# EAGLE design MOD-Y_cold_V03 (EAGLE 9.6.2)

## Sheet 1 of 2
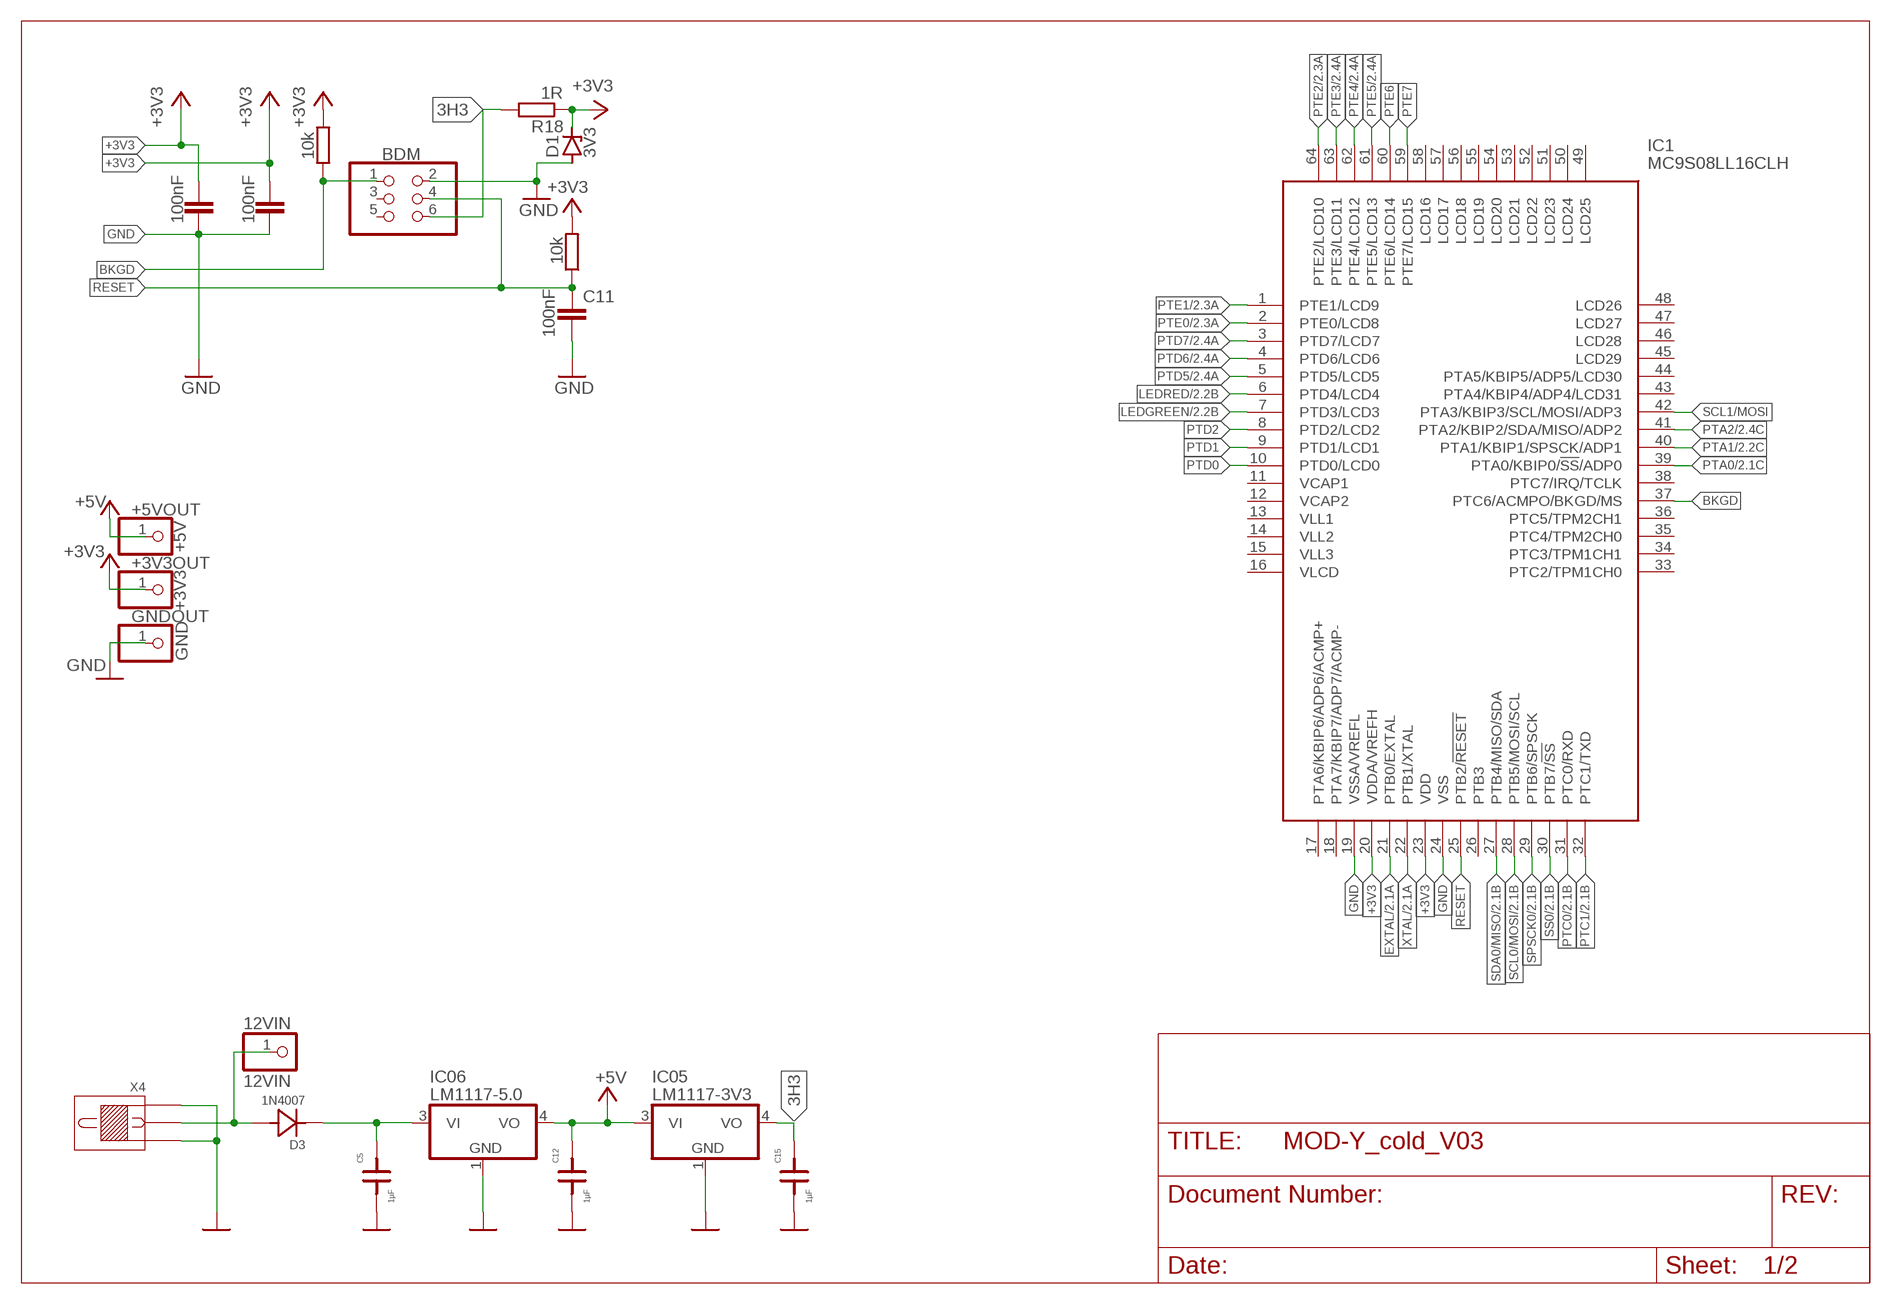
[diagram p0: schematic, sheet 1]

### Parts
12VIN  12VIN  PINHD-1X1  [1X01]
+3V3OUT  +3V3  PINHD-1X1  [1X01]
+5VOUT  +5V  PINHD-1X1  [1X01]
BDM  PINHD-2X3  [2X03]
C5  1µF  C1  [0805F]
C9  100nF  C-EUC0805  [C0805]
C10  100nF  C-EUC0805  [C0805]
C11  100nF  C-EUC0805  [C0805]
C12  1µF  C1  [0805F]
C15  1µF  C1  [0805F]
D1  3V3  ZENER-DIODESOD80C  [SOD80C]
D3  1N4007  DHCMELF  [MELF_B]
GNDOUT  GND  PINHD-1X1  [1X01]
IC1  MC9S08LL16CLH  [QFP50P1200X1200X160-64N]
IC05  LM1117-3V3  LM1117DT  [DPAK]
IC06  LM1117-5.0  LM1117DT  [DPAK]
R16  10k  R-EU_R0805  [R0805]
R17  10k  R-EU_R0805  [R0805]
R18  1R  R-EU_R0805  [R0805]
X4  SPP  [SPP]

### Nets
3H3: BDM.6 C15.2 IC05.4(VO) R18.2
+3V3: +3V3OUT.1 C9.1 C10.1 D1.C IC1.20(VDDA/VREFH) IC1.23(VDD) R16.2 R17.2 R18.1 ; also sheet 2
+5V: +5VOUT.1 C12.2 IC05.3(VI) IC06.4(VO) ; also sheet 2
BKGD: BDM.1 IC1.37(PTC6/ACMPO/BKGD/MS) R16.1
EXTAL: IC1.21(PTB0/EXTAL) ; also sheet 2
GND: BDM.2 C5.1 C9.2 C10.2 C11.2 C12.1 C15.1 D1.A GNDOUT.1 IC1.19(VSSA/VREFL) IC1.24(VSS) IC05.1(GND) IC06.1(GND) X4.1 X4.3 ; also sheet 2
LEDGREEN: IC1.7(PTD3/LCD3) ; also sheet 2
LEDRED: IC1.6(PTD4/LCD4) ; also sheet 2
N$70: C5.2 D3.K IC06.3(VI)
N$71: 12VIN.1 D3.A X4.2
PTA0: IC1.39(PTA0/KBIP0/!SS!/ADP0) ; also sheet 2
PTA1: IC1.40(PTA1/KBIP1/SPSCK/ADP1) ; also sheet 2
PTA2: IC1.41(PTA2/KBIP2/SDA/MISO/ADP2) ; also sheet 2
PTC0: IC1.31(PTC0/RXD) ; also sheet 2
PTC1: IC1.32(PTC1/TXD) ; also sheet 2
PTD0: IC1.10(PTD0/LCD0)
PTD1: IC1.9(PTD1/LCD1)
PTD2: IC1.8(PTD2/LCD2)
PTD5: IC1.5(PTD5/LCD5) ; also sheet 2
PTD6: IC1.4(PTD6/LCD6) ; also sheet 2
PTD7: IC1.3(PTD7/LCD7) ; also sheet 2
PTE0: IC1.2(PTE0/LCD8) ; also sheet 2
PTE1: IC1.1(PTE1/LCD9) ; also sheet 2
PTE2: IC1.64(PTE2/LCD10) ; also sheet 2
PTE3: IC1.63(PTE3/LCD11) ; also sheet 2
PTE4: IC1.62(PTE4/LCD12) ; also sheet 2
PTE5: IC1.61(PTE5/LCD13) ; also sheet 2
PTE6: IC1.60(PTE6/LCD14)
PTE7: IC1.59(PTE7/LCD15)
RESET: BDM.4 C11.1 IC1.25(PTB2/!RESET) R17.1
SCL0/MOSI: IC1.28(PTB5/MOSI/SCL) ; also sheet 2
SCL1/MOSI: IC1.42(PTA3/KBIP3/SCL/MOSI/ADP3)
SDA0/MISO: IC1.27(PTB4/MISO/SDA) ; also sheet 2
SPSCK0: IC1.29(PTB6/SPSCK) ; also sheet 2
SS0: IC1.30(PTB7/!SS) ; also sheet 2
XTAL: IC1.22(PTB1/XTAL) ; also sheet 2
Unconnected: BDM.3 BDM.5 IC1.11(VCAP1) IC1.12(VCAP2) IC1.13(VLL1) IC1.14(VLL2) IC1.15(VLL3) IC1.16(VLCD) IC1.17(PTA6/KBIP6/ADP6/ACMP+) IC1.18(PTA7/KBIP7/ADP7/ACMP-) IC1.26(PTB3) IC1.33(PTC2/TPM1CH0) IC1.34(PTC3/TPM1CH1) IC1.35(PTC4/TPM2CH0) IC1.36(PTC5/TPM2CH1) IC1.38(PTC7/IRQ/TCLK) IC1.43(PTA4/KBIP4/ADP4/LCD31) IC1.44(PTA5/KBIP5/ADP5/LCD30) IC1.45(LCD29) IC1.46(LCD28) IC1.47(LCD27) IC1.48(LCD26) IC1.49(LCD25) IC1.50(LCD24) IC1.51(LCD23) IC1.52(LCD22) IC1.53(LCD21) IC1.54(LCD20) IC1.55(LCD19) IC1.56(LCD18) IC1.57(LCD17) IC1.58(LCD16)

## Sheet 2 of 2
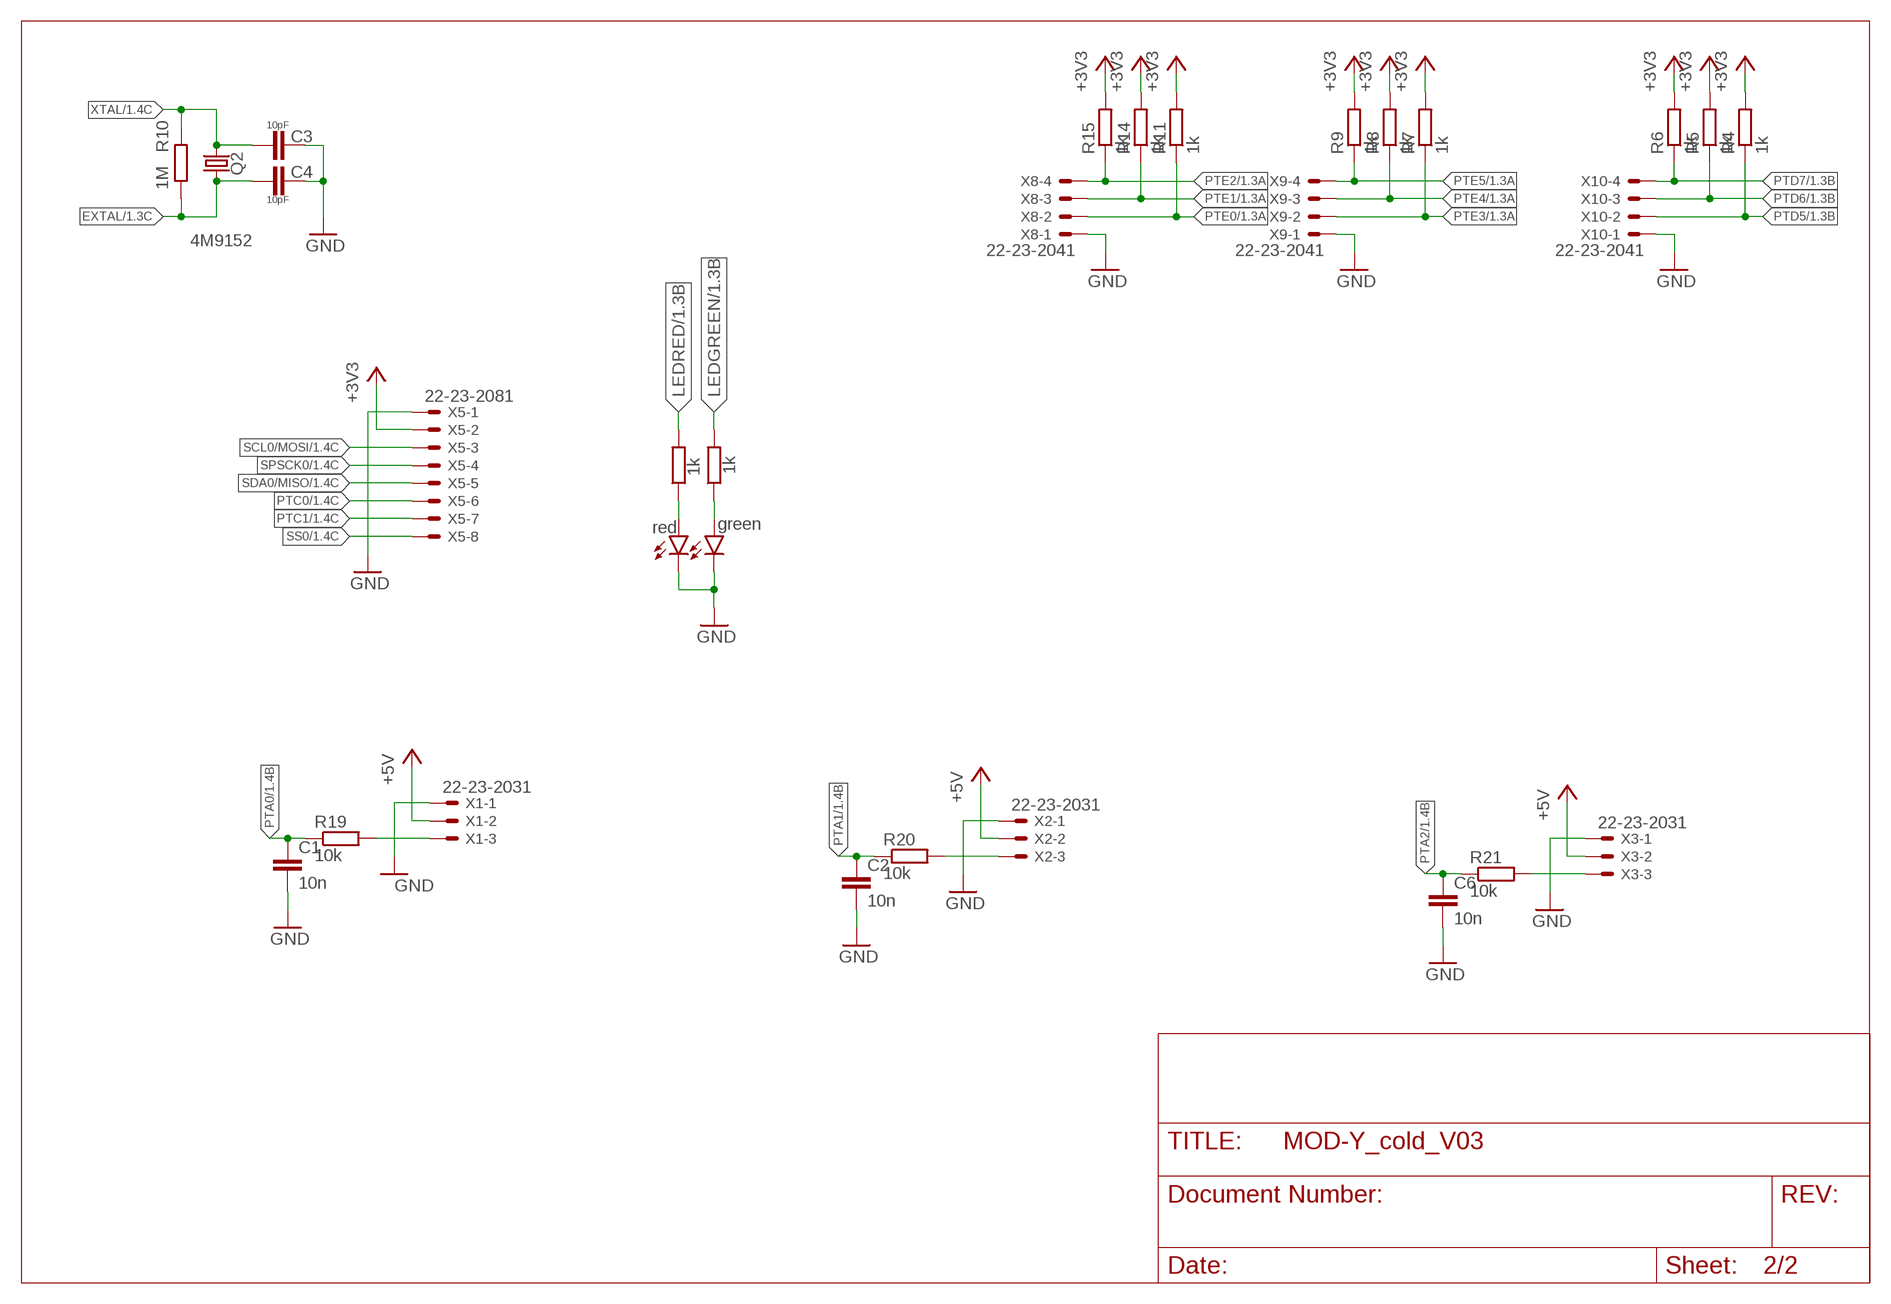
[diagram p1: schematic, sheet 2]

### Parts
C1  10n  C-EUC0805  [C0805]
C2  10n  C-EUC0805  [C0805]
C3  10pF  C-EUC0805  [C0805]
C4  10pF  C-EUC0805  [C0805]
C6  10n  C-EUC0805  [C0805]
LED1  green  LEDCHIP-LED0805  [CHIP-LED0805]
LED2  red  LEDCHIP-LED0805  [CHIP-LED0805]
Q2  4M9152  CRYSTALHC49UP  [HC49UP]
R4  1k  R-EU_R0805  [R0805]
R5  1k  R-EU_R0805  [R0805]
R6  1k  R-EU_R0805  [R0805]
R7  1k  R-EU_R0805  [R0805]
R8  1k  R-EU_R0805  [R0805]
R9  1k  R-EU_R0805  [R0805]
R10  1M  R-EU_R0805  [R0805]
R11  1k  R-EU_R0805  [R0805]
R12  1k  R-EU_R0805  [R0805]
R13  1k  R-EU_R0805  [R0805]
R14  1k  R-EU_R0805  [R0805]
R15  1k  R-EU_R0805  [R0805]
R19  10k  R-EU_R0805  [R0805]
R20  10k  R-EU_R0805  [R0805]
R21  10k  R-EU_R0805  [R0805]
X1  22-23-2031  [22-23-2031]
X2  22-23-2031  [22-23-2031]
X3  22-23-2031  [22-23-2031]
X5  22-23-2081  [22-23-2081]
X8  22-23-2041  [22-23-2041]
X9  22-23-2041  [22-23-2041]
X10  22-23-2041  [22-23-2041]

### Nets
+3V3: R4.2 R5.2 R6.2 R7.2 R8.2 R9.2 R11.2 R14.2 R15.2 X5.2 ; also sheet 1
+5V: X1.2 X2.2 X3.2 ; also sheet 1
EXTAL: C4.1 Q2.1 R10.1 ; also sheet 1
GND: C1.2 C2.2 C3.2 C4.2 C6.2 LED1.C LED2.C X1.1 X2.1 X3.1 X5.1 X8.1 X9.1 X10.1 ; also sheet 1
LEDGREEN: R13.2 ; also sheet 1
LEDRED: R12.2 ; also sheet 1
N$1: R21.2 X3.3
N$3: R19.2 X1.3
N$6: R20.2 X2.3
N$17: LED2.A R12.1
N$18: LED1.A R13.1
PTA0: C1.1 R19.1 ; also sheet 1
PTA1: C2.1 R20.1 ; also sheet 1
PTA2: C6.1 R21.1 ; also sheet 1
PTC0: X5.6 ; also sheet 1
PTC1: X5.7 ; also sheet 1
PTD5: R4.1 X10.2 ; also sheet 1
PTD6: R5.1 X10.3 ; also sheet 1
PTD7: R6.1 X10.4 ; also sheet 1
PTE0: R11.1 X8.2 ; also sheet 1
PTE1: R14.1 X8.3 ; also sheet 1
PTE2: R15.1 X8.4 ; also sheet 1
PTE3: R7.1 X9.2 ; also sheet 1
PTE4: R8.1 X9.3 ; also sheet 1
PTE5: R9.1 X9.4 ; also sheet 1
SCL0/MOSI: X5.3 ; also sheet 1
SDA0/MISO: X5.5 ; also sheet 1
SPSCK0: X5.4 ; also sheet 1
SS0: X5.8 ; also sheet 1
XTAL: C3.1 Q2.2 R10.2 ; also sheet 1

## Library data of the parts
12VIN +3V3OUT +5VOUT GNDOUT = pinhead:PINHD-1X1: PIN HEADER
BDM = pinhead:PINHD-2X3: PIN HEADER
C1-C4 C6 C9-C11 = rcl:C-EU: CAPACITOR, European symbol; SPICEPREFIX: C
C5 C12 C15 = deto:C
D1 = diode:ZENER-DIODE: Z-Diode
D3 = deto:DHC: Hii-Curr-Diode, Silizium, Typ Gleichrichter z.B. wie 1N4007 oder ähnlich
IC1 = MC9S08LL16CLH:MC9S08LL16CLH: MCU 8-bit S08 CISC 16KB Flash 2.5V/3.3V 64-Pin LQFP Tray Source: Datasheet <http://www.nxp.com/docs/en/data-sheet/MC9S08LL16.pdf>; ARROW_PART_NUMBER: MC9S08LL16CLH; ARROW_PRICE-STOCK: https://www.arrow.com/en/products/mc9s08ll16clh/nxp-semiconductors; DESCRIPTION: MCU 8-bit S08 CISC 16KB Flash 2.5V/3.3V 64-Pin LQFP Tray; HEIGHT: 1.6mm; MANUFACTURER_NAME: NXP; MANUFACTURER_PART_NUMBER: MC9S08LL16CLH; MOUSER_PART_NUMBER: 841-MC9S08LL16CLH; MOUSER_PRICE-STOCK: https://www.mouser.com/Search/Refine.aspx?Keyword=841-MC9S08LL16CLH
IC05 IC06 = deto:LM1117: Spannungsregler Fix oder einstellbar LM1117XX-YY wobei XX die Gehäuseform angibt (DT = Dpak) und YY die Spannung angibt (z.B. 5.0 für 5V oder ADJ für einstellbar)
LED1 LED2 = led:LED: LED OSRAM: - CHIPLED LG R971, LG N971, LY N971, LG Q971, LY Q971, LO R971, LY R971 LH N974, LH R974 LS Q976, LO Q976, LY Q976 LO Q996 - Hyper CHIPLED LW Q18S LB Q993, LB Q99A, LB R99A - SideLED LS A670, LO A670, LY A670, LG A670, LP A670 LB A673, LV A673, LT A673, LW A673 LH A674 LY A675 LS A676, LA A676, LO A676, LY A676, LW A676 LS A679, LY A679, LG A679 - Hyper Micro SIDELED® LS Y876, LA Y876, LO Y876, LY Y876 LT Y87S - SmartLED LW L88C, LW L88S LB L89C, LB L89S, LG L890 LS L89K, LO L89K, LY L89K LS L896, LA L896, LO L896, LY L896 - TOPLED LS T670, LO T670, LY T670, LG T670, LP T670 LSG T670, LSP T670, LSY T670, LOP T670, LYG T670 LG T671, LOG T671, LSG T671 LB T673, LV T673, LT T673, LW T673 LH T674 LS T676, LA T676, LO T676, LY T676, LB T676, LH T676, LSB T676, LW T676 LB T67C, LV T67C, LT T67C, LS T67K, LO T67K, LY T67K, LW E67C LS E67B, LA E67B, LO E67B, LY E67B, LB E67C, LV E67C, LT E67C LW T67C LS T679, LY T679, LG T679 LS T770, LO T770, LY T770, LG T770, LP T770 LB T773, LV T773, LT T773, LW T773 LH T774 LS E675, LA E675, LY E675, LS T675 LS T776, LA T776, LO T776, LY T776, LB T776 LHGB T686 LT T68C, LB T68C - Hyper Mini TOPLED® LB M676 - Mini TOPLED Santana® LG M470 LS M47K, LO M47K, LY M47K Source: http://www.osram.convergy.de LUXEON: - LUMILED® LXK2-PW12-R00, LXK2-PW12-S00, LXK2-PW14-U00, LXK2-PW14-V00 LXK2-PM12-R00, LXK2-PM12-S00, LXK2-PM14-U00 LXK2-PE12-Q00, LXK2-PE12-R00, LXK2-PE12-S00, LXK2-PE14-T00, LXK2-PE14-U00 LXK2-PB12-K00, LXK2-PB12-L00, LXK2-PB12-M00, LXK2-PB14-N00, LXK2-PB14-P00, LXK2-PB14-Q00 LXK2-PR12-L00, LXK2-PR12-M00, LXK2-PR14-Q00, LXK2-PR14-R00 LXK2-PD12-Q00, LXK2-PD12-R00, LXK2-PD12-S00 LXK2-PH12-R00, LXK2-PH12-S00 LXK2-PL12-P00, LXK2-PL12-Q00, LXK2-PL12-R00 Source: www.luxeon.com KINGBRIGHT: KA-3528ASYC Source: www.kingbright.com
Q2 = crystal:CRYSTAL: CRYSTAL; OC_FARNELL: unknown; OC_NEWARK: unknown
R4-R21 = rcl:R-EU_: RESISTOR, European symbol; SPICEPREFIX: R
X1-X3 = con-molex:22-23-2031: .100" (2.54mm) Center Header - 3 Pin; MF: MOLEX; MPN: 22-23-2031; OC_FARNELL: 1462950; OC_NEWARK: 30C0862
X4 = CONNECT:SPP
X5 = con-molex:22-23-2081: .100" (2.54mm) Center Header - 8 Pin; MF: MOLEX; MPN: 22-23-2081; OC_FARNELL: 1756826; OC_NEWARK: 01C7592
X8-X10 = con-molex:22-23-2041: .100" (2.54mm) Center Header - 4 Pin; MF: MOLEX; MPN: 22-23-2041; OC_FARNELL: 1462920; OC_NEWARK: 38C0355

## Board
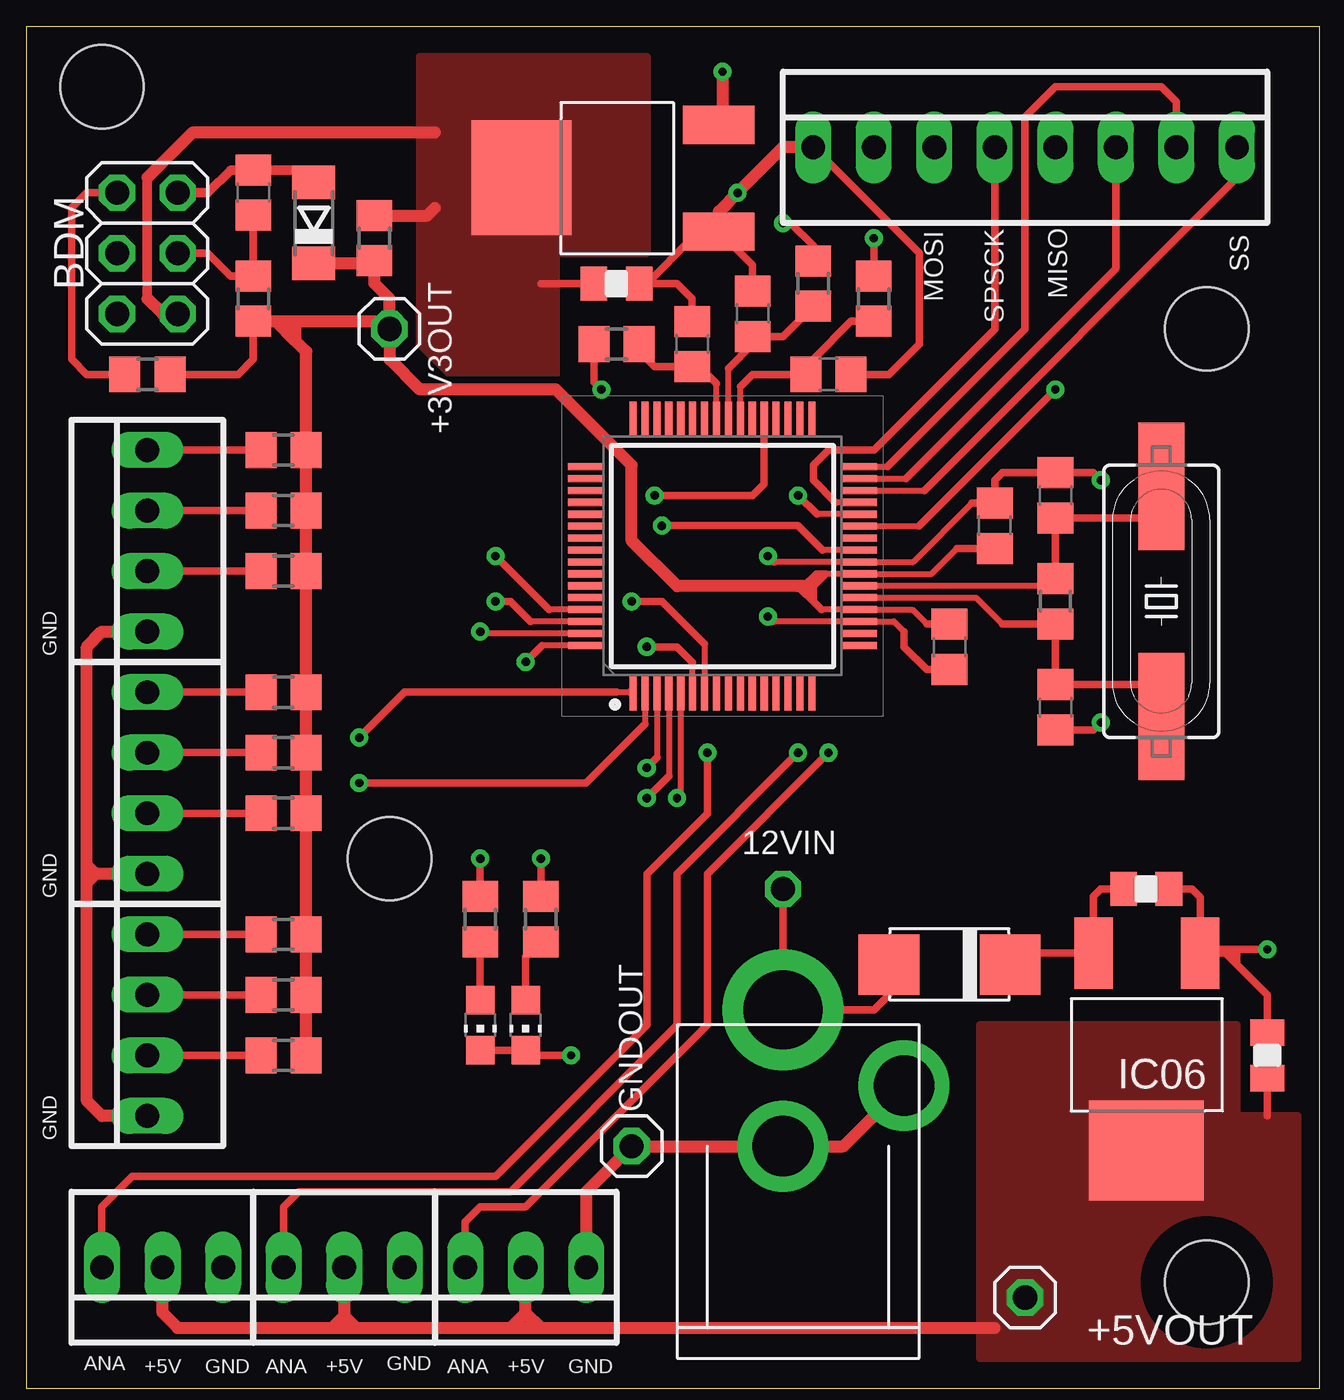
[diagram p2: board, top side]
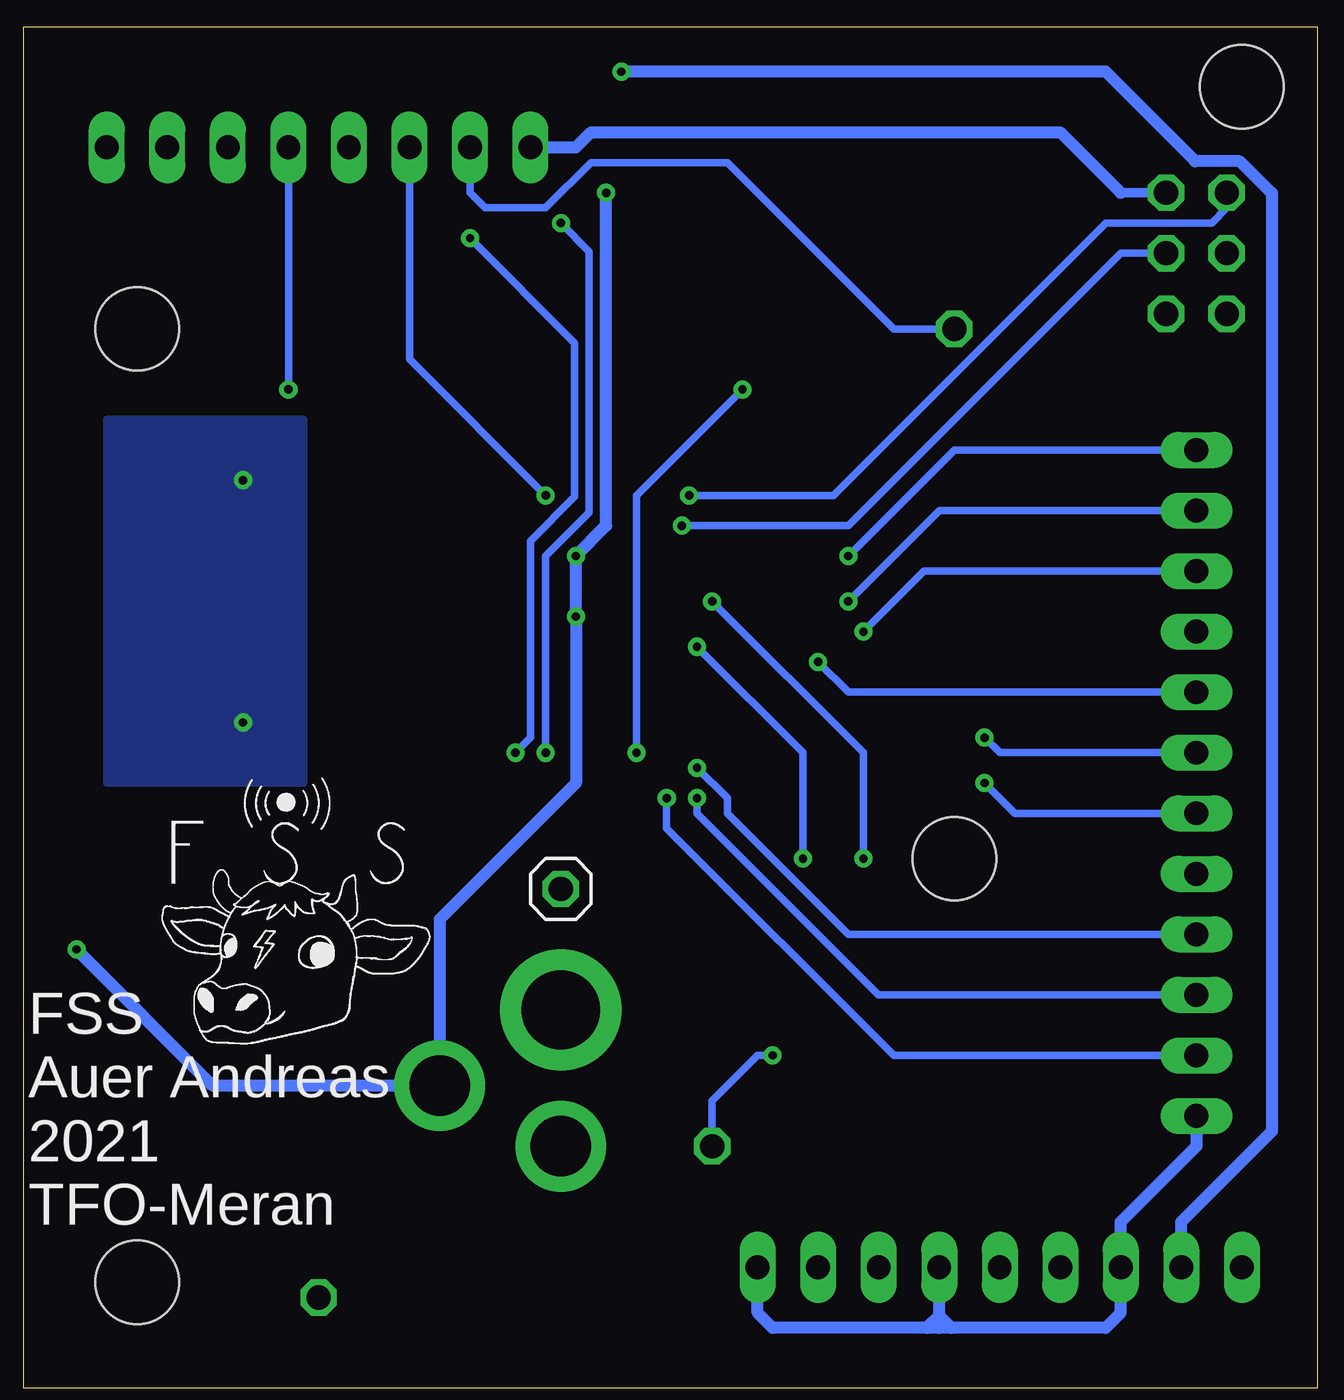
[diagram p3: board, bottom side, seen from below]

No outline drawn. Coordinates in mm, seen from the top.
Copper layers (1*16): Top 0.035mm / dielectric 1.5mm / Bottom 0.035mm
Design rules "default *": minimum track width 6mil, minimum drill 0.35mm, track to track 12mil, track to pad 12mil, pad to pad 12mil, via to via 12mil, smd to smd 12mil, copper to edge 40mil, drill to drill 12mil, minimum pad ring 10mil, minimum via ring 8mil, stop-mask expansion 4mil, vias tented up to drill 0mil, thermal gap 10mil
Holes 3.5 mm at 49.53,4.45 49.53,44.45 3.17,54.61 15.24,22.23
Milling: 4 lines

### Footprints (pad centres in the part's own frame; a part is rotated, then mirrored left to right if it is on the bottom)
1X01 = drill 1.016 octagon: 1 0,0
2X03 = drill 1.016 octagon: 1 -2.54,-1.27; 2 -2.54,1.27; 3 0,-1.27; 4 0,1.27; 5 2.54,-1.27; 6 2.54,1.27
C0805 = smd 1.3 x 1.5: 1 -0.95,0; 2 0.95,0
0805F = smd 1.118 x 1.422: 1 -0.953,0; 2 0.953,0
SOD80C = smd 1.4 x 1.8: A 1.7,0; C -1.7,0
MELF_B = smd 2.54 x 2.54: A 2.54,0; K -2.54,0
QFP50P1200X1200X160-64N = smd 1.475 x 0.3: 1 -5.738,3.75; 2 -5.738,3.25; 3 -5.738,2.75; 4 -5.738,2.25; 5 -5.738,1.75; 6 -5.738,1.25; 7 -5.738,0.75; 8 -5.738,0.25; 9 -5.738,-0.25; 10 -5.738,-0.75; 11 -5.738,-1.25; 12 -5.738,-1.75; 13 -5.738,-2.25; 14 -5.738,-2.75; 15 -5.738,-3.25; 16 -5.738,-3.75; 33 5.738,-3.75; 34 5.738,-3.25; 35 5.738,-2.75; 36 5.738,-2.25; 37 5.738,-1.75; 38 5.738,-1.25; 39 5.738,-0.75; 40 5.738,-0.25; 41 5.738,0.25; 42 5.738,0.75; 43 5.738,1.25; 44 5.738,1.75; 45 5.738,2.25; 46 5.738,2.75; 47 5.738,3.25; 48 5.738,3.75 | smd 0.3 x 1.475: 17 -3.75,-5.738; 18 -3.25,-5.738; 19 -2.75,-5.738; 20 -2.25,-5.738; 21 -1.75,-5.738; 22 -1.25,-5.738; 23 -0.75,-5.738; 24 -0.25,-5.738; 25 0.25,-5.738; 26 0.75,-5.738; 27 1.25,-5.738; 28 1.75,-5.738; 29 2.25,-5.738; 30 2.75,-5.738; 31 3.25,-5.738; 32 3.75,-5.738; 49 3.75,5.738; 50 3.25,5.738; 51 2.75,5.738; 52 2.25,5.738; 53 1.75,5.738; 54 1.25,5.738; 55 0.75,5.738; 56 0.25,5.738; 57 -0.25,5.738; 58 -0.75,5.738; 59 -1.25,5.738; 60 -1.75,5.738; 61 -2.25,5.738; 62 -2.75,5.738; 63 -3.25,5.738; 64 -3.75,5.738
DPAK = smd 1.6 x 2.997: 1 -2.261,-3.658; 3 2.21,-3.658 | smd 4.826 x 4.191: 4 0,4.623
CHIP-LED0805 = smd 1.2 x 1.2: A 0,-1.05; C 0,1.05
HC49UP = smd 5.334 x 1.93: 1 -4.826,0; 2 4.826,0
R0805 = smd 1.3 x 1.5: 1 -0.95,0; 2 0.95,0
22-23-2031 = drill 1 long: 1 -2.54,0; 2 0,0; 3 2.54,0
SPP = drill 2.54 pad 3.81: 1 0,0; 3 -2.54,5.08 | drill 3.302 pad 5.08: 2 -5.715,0
22-23-2081 = drill 1 long: 1 -8.89,0; 2 -6.35,0; 3 -3.81,0; 4 -1.27,0; 5 1.27,0; 6 3.81,0; 7 6.35,0; 8 8.89,0
22-23-2041 = drill 1 long: 1 -3.81,0; 2 -1.27,0; 3 1.27,0; 4 3.81,0

### Placement (x,y rotation side)
12VIN  31.75,20.95 0 bottom
+3V3OUT  15.24,44.45 0 top
+5VOUT  41.91,3.81 0 top
BDM  5.08,47.62 270 top
C1  33.66,42.55 0 top
C2  30.48,45.09 90 top
C3  43.18,37.47 90 top
C4  43.18,28.57 270 top
C5  46.99,20.95 180 top
C6  27.94,43.81 90 top
C9  38.73,31.11 270 top
C10  40.64,36.2 90 top
C11  9.53,50.16 90 top
C12  52.07,13.97 270 top
C15  24.77,46.35 180 top
D1  12.06,48.9 90 top
D3  38.73,17.78 180 top
GNDOUT  25.4,10.16 0 top
IC1  29.21,34.92 90 top
IC05  25.4,50.8 90 top
IC06  46.99,14.61 180 top
LED1  19.05,15.24 180 top
LED2  20.95,15.24 180 top
Q2  47.62,33.02 90 top
R4  10.79,13.97 0 top
R5  10.79,16.51 0 top
R6  10.79,19.05 0 top
R7  10.79,34.29 0 top
R8  10.79,36.83 0 top
R9  10.79,39.37 0 top
R10  43.18,33.02 90 top
R11  10.79,24.13 0 top
R12  21.59,19.68 90 top
R13  19.05,19.68 90 top
R14  10.79,26.67 0 top
R15  10.79,29.21 0 top
R16  5.08,42.55 0 top
R17  9.53,45.72 270 top
R18  14.61,48.26 90 top
R19  35.56,45.72 90 top
R20  33.02,46.35 90 top
R21  24.77,43.81 180 top
X1  20.95,5.08 180 top
X2  13.34,5.08 180 top
X3  5.71,5.08 180 top
X4  31.75,10.16 270 top
X5  41.91,52.07 0 top
X8  5.08,25.4 90 top
X9  5.08,35.56 90 top
X10  5.08,15.24 90 top

### Tracks (layer width: path | path; a pad name or v marks a point on that pad's centre or on a via)
3H3
  Top 0.305: C15.2 21.59,46.35
  Top 0.406: 5.08,45.72 5.08,50.8
  Top 0.508: BDM.6 5.71,45.09 5.08,45.72 | 5.08,50.8 6.99,52.7 17.14,52.7 | R18.2 16.82,49.21 17.14,49.53
  pour Top (no thermals): 16.51,55.88 16.51,43.81 17.78,42.55 22.23,42.55 22.23,47.62 26.04,47.62 26.04,55.88
+3V3
  Top 0.254: 39.05,35.24 37.98,34.17 IC1.23 33.54,34.17 | 37.78,32.06 37.17,32.67 IC1.20 33.37,32.67
  Top 0.305: C10.1 39.05,35.24 | 37.78,32.06 C9.1 | 33.37,32.67 33.02,33.02 | 33.02,33.66 33.02,33.02 | 33.02,33.66 33.54,34.17 33.41,34.17 | 33.02,33.66 32.89,33.66 | 32.89,33.66 32.64,33.66 | 33.41,34.17 32.89,33.66 | 32.64,33.4 32.38,33.66 | 32.89,33.15 32.64,33.4 | 32.64,33.4 32.64,33.66 | 33.02,33.02 32.89,33.15 | 32.89,33.15 32.89,33.66 | 33.41,34.17 33.16,34.17 32.64,33.66 | R16.2 8.89,42.55 9.53,43.18 R17.2
  Top 0.508: R4.2 R5.2 R6.2 R11.2 R14.2 R15.2 R7.2 R8.2 R9.2 11.74,43.5 11.3,43.94 | 11.3,43.94 10.47,44.77 | 32.64,33.66 32.38,33.66 27.3,33.66 25.4,35.56 25.4,38.73 22.23,41.91 16.51,41.91 15.24,43.18 +3V3OUT.1 | 10.47,44.77 R17.2 14.92,44.77 +3V3OUT.1 | 10.47,44.77 11.3,44.77 11.3,43.94 | D1.C 14.49,47.2 R18.1 14.61,46.35 15.24,45.72 +3V3OUT.1
  Bottom 0.305: +3V3OUT.1 17.78,44.45 24.77,51.44 30.48,51.44 32.38,49.53 34.92,49.53 35.56,50.16 X5.2
+5V  (via drill 0.35)
  Top 0.305: 21.59,2.54 21.46,2.54 20.95,3.05 | C12.2 52.07,11.43 | 29.21,53.16 IC05.3
  Top 0.508: 12.83,2.54 6.35,2.54 5.71,3.17 X3.2 | 12.83,2.54 13.34,2.54 | 13.34,2.54 13.84,2.54 | 13.84,2.54 20.32,2.54 | 20.32,2.54 20.95,3.17 21.59,2.54 40.64,2.54 | 13.84,2.54 13.34,3.05 12.83,2.54 | 20.32,2.54 21.46,2.54 | v29.21,55.24 29.21,53.16 | X2.2 13.34,2.54 | 20.95,3.05 X1.2
  Bottom 0.508: v29.21,55.24 8.89,55.24 5.13,51.49 3.26,51.49 1.94,50.16 1.91,50.16 1.91,10.79 5.71,6.99 X3.2
  pour Top (no thermals): 40.01,15.24 40.01,1.27 53.34,1.27 53.34,11.43 50.8,11.43 50.8,15.24
BKGD  (via drill 0.35)
  Top 0.305: BDM.1 2.54,50.16 1.91,49.53 1.91,43.18 2.54,42.55 R16.1 | IC1.37 30.96,37.95 30.48,37.47 v26.37,37.47
  Bottom 0.305: BDM.1 3.81,49.53 4.45,48.9 8.89,48.9 20.32,37.47 v26.37,37.47
EXTAL
  Top 0.152: 43.18,31.75 R10.1
  Top 0.254: IC1.21 39.85,33.17 40.95,32.07
  Top 0.305: 43.18,31.75 C4.1 47.31,29.52 47.62,29.21 Q2.1 | 40.95,32.07 R10.1
GND  (via drill 0.35)
  Top 0.254: 39.69,37.15 37.22,34.67 IC1.24 31.36,34.67 | 36.83,31.75 36.41,32.17 IC1.19 31.32,32.17
  Top 0.305: v45.09,38.1 44.77,38.41 C3.2 40.95,38.41 40.64,38.1 C10.2 39.69,37.15 | C4.2 44.77,27.62 v45.09,27.94 | X8.1 2.54,21.59 | LED1.C LED2.C 21.18,13.97 v22.86,13.97 | 50.55,18.03 50.32,18.26 IC06.1 49.25,18.41 | C12.1 52.07,16.51 50.8,17.78 | 49.25,18.41 49.25,20.6 48.9,20.95 C5.1 | v52.07,18.41 50.8,18.41 | 50.8,18.41 50.55,18.41 | 50.55,18.41 49.25,18.41 | 50.55,18.03 50.8,17.78 | 50.55,18.03 50.55,18.41 | 50.8,17.78 50.8,18.41 | 36.83,31.75 36.83,31.11 37.78,30.16 C9.2 | 31.32,32.17 v31.11,32.38 | 31.36,34.67 v31.11,34.92 | C6.2 27.94,45.72 27.3,46.35 C15.1 26.04,46.35 27.94,48.26 28.78,48.26 IC05.1 30.48,47.12 C2.2 | C1.2 36.2,42.55 37.47,43.81 37.47,47.62 X5.1
  Top 0.406: BDM.2 7.62,50.16 8.57,51.12 C11.2 11.54,51.12 D1.A
  Top 0.508: X10.1 3.17,11.43 2.54,12.06 2.54,21.21 | 2.54,21.21 2.54,21.59 2.54,21.97 | 2.54,21.97 2.54,31.11 3.17,31.75 X9.1 | 2.92,21.59 2.54,21.97 | X8.1 2.92,21.59 | 2.92,21.59 2.54,21.21 | X4.3 34.29,10.16 X4.1 GNDOUT.1 23.5,8.26 X1.1 | X5.1 31.75,52.07 v29.84,50.16 29.06,49.38 IC05.1
  Bottom 0.305: v22.86,13.97 23.5,13.97 25.4,12.06 GNDOUT.1
  Bottom 0.406: 8.26,50.16 BDM.2
  Bottom 0.508: X10.1 5.08,10.16 8.26,6.99 X3.1 8.26,3.17 8.89,2.54 15.37,2.54 | 15.37,2.54 15.88,2.54 | 15.88,2.54 16.38,2.54 | 16.38,2.54 22.86,2.54 23.5,3.17 X1.1 | 15.37,2.54 15.88,3.05 16.38,2.54 | v52.07,18.41 46.35,12.7 X4.3 36.83,19.68 31.11,25.4 v31.11,32.38 v31.11,34.92 29.84,36.2 v29.84,50.16 | 15.88,2.54 X2.1 | 8.26,50.16 10.79,52.7 30.48,52.7 31.11,52.07 X5.1
  pour Bottom: 42.55,40.64 50.8,40.64 50.8,25.4 42.55,25.4
LEDGREEN  (via drill 0.35)
  Top 0.254: 28.46,31.23 IC1.7
  Top 0.305: v19.05,22.23 R13.2 | v25.4,33.02 26.67,33.02 28.46,31.23
  Bottom 0.305: v19.05,22.23 19.05,26.67 v25.4,33.02
LEDRED  (via drill 0.35)
  Top 0.254: IC1.6 27.96,30.46
  Top 0.305: v21.59,22.23 R12.2 | 27.96,30.46 27.3,31.11 v26.04,31.11
  Bottom 0.305: v21.59,22.23 21.59,26.67 v26.04,31.11
N$1  (via drill 0.35)
  Top 0.305: R21.2 23.82,42.23 v24.13,41.91 | X3.3 3.17,7.62 4.45,8.89 19.68,8.89 26.04,15.24 26.04,21.59 28.57,24.13 v28.57,26.67
  Bottom 0.305: v28.57,26.67 28.57,37.47 v24.13,41.91
N$3  (via drill 0.35)
  Top 0.305: X1.3 18.41,6.99 19.05,7.62 20.95,7.62 28.57,15.24 28.57,21.59 v33.66,26.67 | R19.2 v35.56,48.26
  Bottom 0.305: v33.66,26.67 33.02,27.3 33.02,35.56 31.17,37.41 31.17,43.87 v35.56,48.26
N$6  (via drill 0.35)
  Top 0.305: X2.3 10.79,7.62 11.43,8.26 20.32,8.26 27.3,15.24 27.3,21.59 v32.38,26.67 | v31.75,48.9 32.06,48.9 33.02,47.94 R20.2
  Bottom 0.305: v31.75,48.9 30.56,47.7 30.56,36.75 32.38,34.92 v32.38,26.67
N$17
  Top 0.305: R12.1 20.95,18.1 LED2.A
N$18
  Top 0.305: R13.1 LED1.A
N$70
  Top 0.305: C5.2 45.09,20.95 44.78,20.65 IC06.3 41.76,18.26 D3.K
N$71
  Top 0.305: D3.A 36.2,16.51 35.56,15.88 X4.2 12VIN.1
PTA0
  Top 0.254: IC1.39 29.96,42.02
  Top 0.305: 29.96,42.02 30.48,42.55 C1.1 33.02,42.86 33.02,43.18 34.61,44.77 R19.1
PTA1
  Top 0.254: IC1.40 29.46,42.8
  Top 0.305: 29.46,42.8 30.48,43.81 C2.1 31.75,44.13 R20.1
PTA2
  Top 0.254: IC1.41 28.96,42.16
  Top 0.305: 28.96,42.16 28.25,42.87 C6.1 26.35,42.87 25.71,43.5 R21.1
PTC0
  Top 0.254: IC1.31 36.91,38.17
  Top 0.305: 36.91,38.17 45.72,46.99 X5.6
PTC1
  Top 0.254: IC1.32 36.13,38.67
  Top 0.305: 36.13,38.67 41.91,44.45 41.91,53.34 43.18,54.61 47.62,54.61 48.26,53.98 X5.7
PTD5  (via drill 0.35)
  Top 0.254: IC1.5 27.46,24.92
  Top 0.305: X10.2 R4.1 | 27.46,24.92 v27.3,24.77
  Bottom 0.305: X10.2 17.78,13.97 27.3,23.5 v27.3,24.77
PTD6  (via drill 0.35)
  Top 0.254: IC1.4 26.96,25.69
  Top 0.305: X10.3 R5.1 | 26.96,25.69 v26.04,24.77
  Bottom 0.305: X10.3 18.41,16.51 26.04,24.13 v26.04,24.77
PTD7  (via drill 0.35)
  Top 0.254: IC1.3 26.46,26.46
  Top 0.305: X10.4 R6.1 | 26.46,26.46 v26.04,26.04
  Bottom 0.305: X10.4 19.68,19.05 24.77,24.13 24.77,24.77 v26.04,26.04
PTE0  (via drill 0.35)
  Top 0.254: IC1.2 25.96,27.86
  Top 0.305: X8.2 R11.1 | 25.96,27.86 23.5,25.4 v13.97,25.4
  Bottom 0.305: X8.2 12.7,24.13 v13.97,25.4
PTE1  (via drill 0.35)
  Top 0.254: 24.77,29.21 25.33,29.21
  Top 0.305: X8.3 R14.1 | IC1.1 25.35,29.19 25.33,29.21 | v13.97,27.3 15.88,29.21 24.77,29.21
  Bottom 0.305: X8.3 13.34,26.67 v13.97,27.3
PTE2  (via drill 0.35)
  Top 0.254: IC1.64 21.65,31.18
  Top 0.305: X8.4 R15.1 | 21.65,31.18 v20.95,30.48
  Bottom 0.305: X8.4 19.68,29.21 v20.95,30.48
PTE3  (via drill 0.35)
  Top 0.254: IC1.63 19.12,31.68
  Top 0.305: X9.2 R7.1 | 19.12,31.68 v19.05,31.75
  Bottom 0.305: X9.2 16.51,34.29 v19.05,31.75
PTE4  (via drill 0.35)
  Top 0.254: IC1.62 21.16,32.17
  Top 0.305: X9.3 R8.1 | 21.16,32.17 20.32,33.02 v19.68,33.02
  Bottom 0.305: X9.3 15.88,36.83 v19.68,33.02
PTE5  (via drill 0.35)
  Top 0.254: IC1.61 21.93,32.67
  Top 0.305: X9.4 R9.1 | 21.93,32.67 v19.68,34.92
  Bottom 0.305: X9.4 15.24,39.37 v19.68,34.92
RESET  (via drill 0.35)
  Top 0.254: IC1.25 33.41,35.17
  Top 0.305: BDM.4 7.62,47.62 8.57,46.67 R17.1 C11.1 | 33.41,35.17 32.38,36.2 29.84,36.2 v26.67,36.2
  Bottom 0.305: BDM.4 8.26,47.62 19.68,36.2 v26.67,36.2
SCL0/MOSI  (via drill 0.35)
  Top 0.254: IC1.28 33.17,36.67
  Top 0.305: 33.17,36.67 v32.38,37.47
  Bottom 0.305: v32.38,37.47 38.1,43.18 X5.3
SDA0/MISO  (via drill 0.35)
  Top 0.254: IC1.27 37.45,36.17
  Top 0.305: 37.45,36.17 v43.18,41.91
  Bottom 0.305: v43.18,41.91 X5.5
SPSCK0
  Top 0.254: IC1.29 33.95,37.17
  Top 0.305: 33.95,37.17 33.02,38.1 33.02,38.73 33.66,39.37 35.56,39.37 40.64,44.45 X5.4
SS0
  Top 0.254: IC1.30 37.67,37.67
  Top 0.305: X5.8 50.8,50.8 37.67,37.67
XTAL
  Top 0.254: IC1.22 42.88,33.67
  Top 0.305: Q2.2 47.62,36.83 47.31,36.52 C3.1 R10.2 42.88,33.67

### Text on the board
tPlace: SS | MOSI | MISO | SPSCK | GND | GND | GND | ANA | +5V | GND | ANA | +5V | GND | ANA | +5V | GND
bPlace: FSS / Auer Andreas / 2021 / TFO-Meran | C:/Users/Kneidl/OneDrive - Bildungsdirektion/Andreas/Oberschule/5. Oberschule 202122/Maturaprjoct/drawing/Logo/FSSLOGOCut_BW.bmp